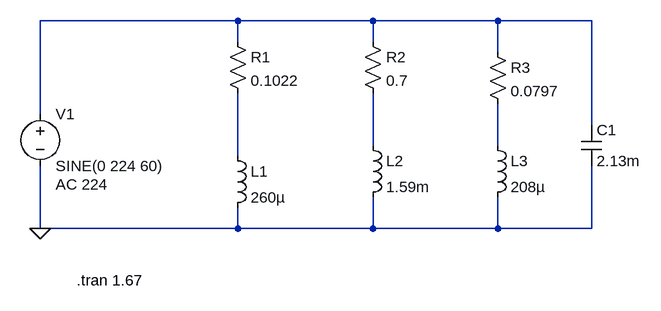
[diagram p0: schematic MARCOS_ANTONIO_TOME_OLIVEIRA1.asc]
MARCOS_ANTONIO_TOME_OLIVEIRA1.asc, the LTspice schematic file:
Version 4.1
SHEET 1 980 680
WIRE 352 0 48 0
WIRE 560 0 352 0
WIRE 752 0 560 0
WIRE 896 0 752 0
WIRE 352 32 352 0
WIRE 560 32 560 0
WIRE 752 48 752 0
WIRE 48 144 48 0
WIRE 896 160 896 0
WIRE 560 192 560 112
WIRE 752 192 752 128
WIRE 352 208 352 112
WIRE 48 320 48 224
WIRE 352 320 352 288
WIRE 352 320 48 320
WIRE 560 320 560 272
WIRE 560 320 352 320
WIRE 752 320 752 272
WIRE 752 320 560 320
WIRE 896 320 896 224
WIRE 896 320 752 320
FLAG 48 320 0
SYMBOL voltage 48 128 R0
WINDOW 123 24 124 Left 2
WINDOW 39 0 0 Left 0
SYMATTR InstName V1
SYMATTR Value SINE(0 224 60)
SYMATTR Value2 AC 224
SYMBOL res 336 16 R0
SYMATTR InstName R1
SYMATTR Value 0.1022
SYMBOL ind 336 192 R0
SYMATTR InstName L1
SYMATTR Value 260µ
SYMBOL res 544 16 R0
SYMATTR InstName R2
SYMATTR Value 0.7
SYMBOL res 736 32 R0
SYMATTR InstName R3
SYMATTR Value 0.0797
SYMBOL cap 880 160 R0
SYMATTR InstName C1
SYMATTR Value 2.13m
SYMBOL ind 544 176 R0
SYMATTR InstName L2
SYMATTR Value 1.59m
SYMBOL ind 736 176 R0
SYMATTR InstName L3
SYMATTR Value 208µ
TEXT 104 400 Left 2 !.tran 1.67

The netlist it stands for:
* MARCOS_ANTONIO_TOME_OLIVEIRA1.asc
V1 N001 0 SINE(0 224 60) AC 224
R1 N001 N004 0.1022
L1 N004 0 260µ
R2 N001 N002 0.7
R3 N001 N003 0.0797
C1 N001 0 2.13m
L2 N002 0 1.59m
L3 N003 0 208µ
.tran 1.67
.backanno
.end